# Altium schematic sheet ESC.SchDoc
size A3; SheetNumber: 1; SheetTotal: 1
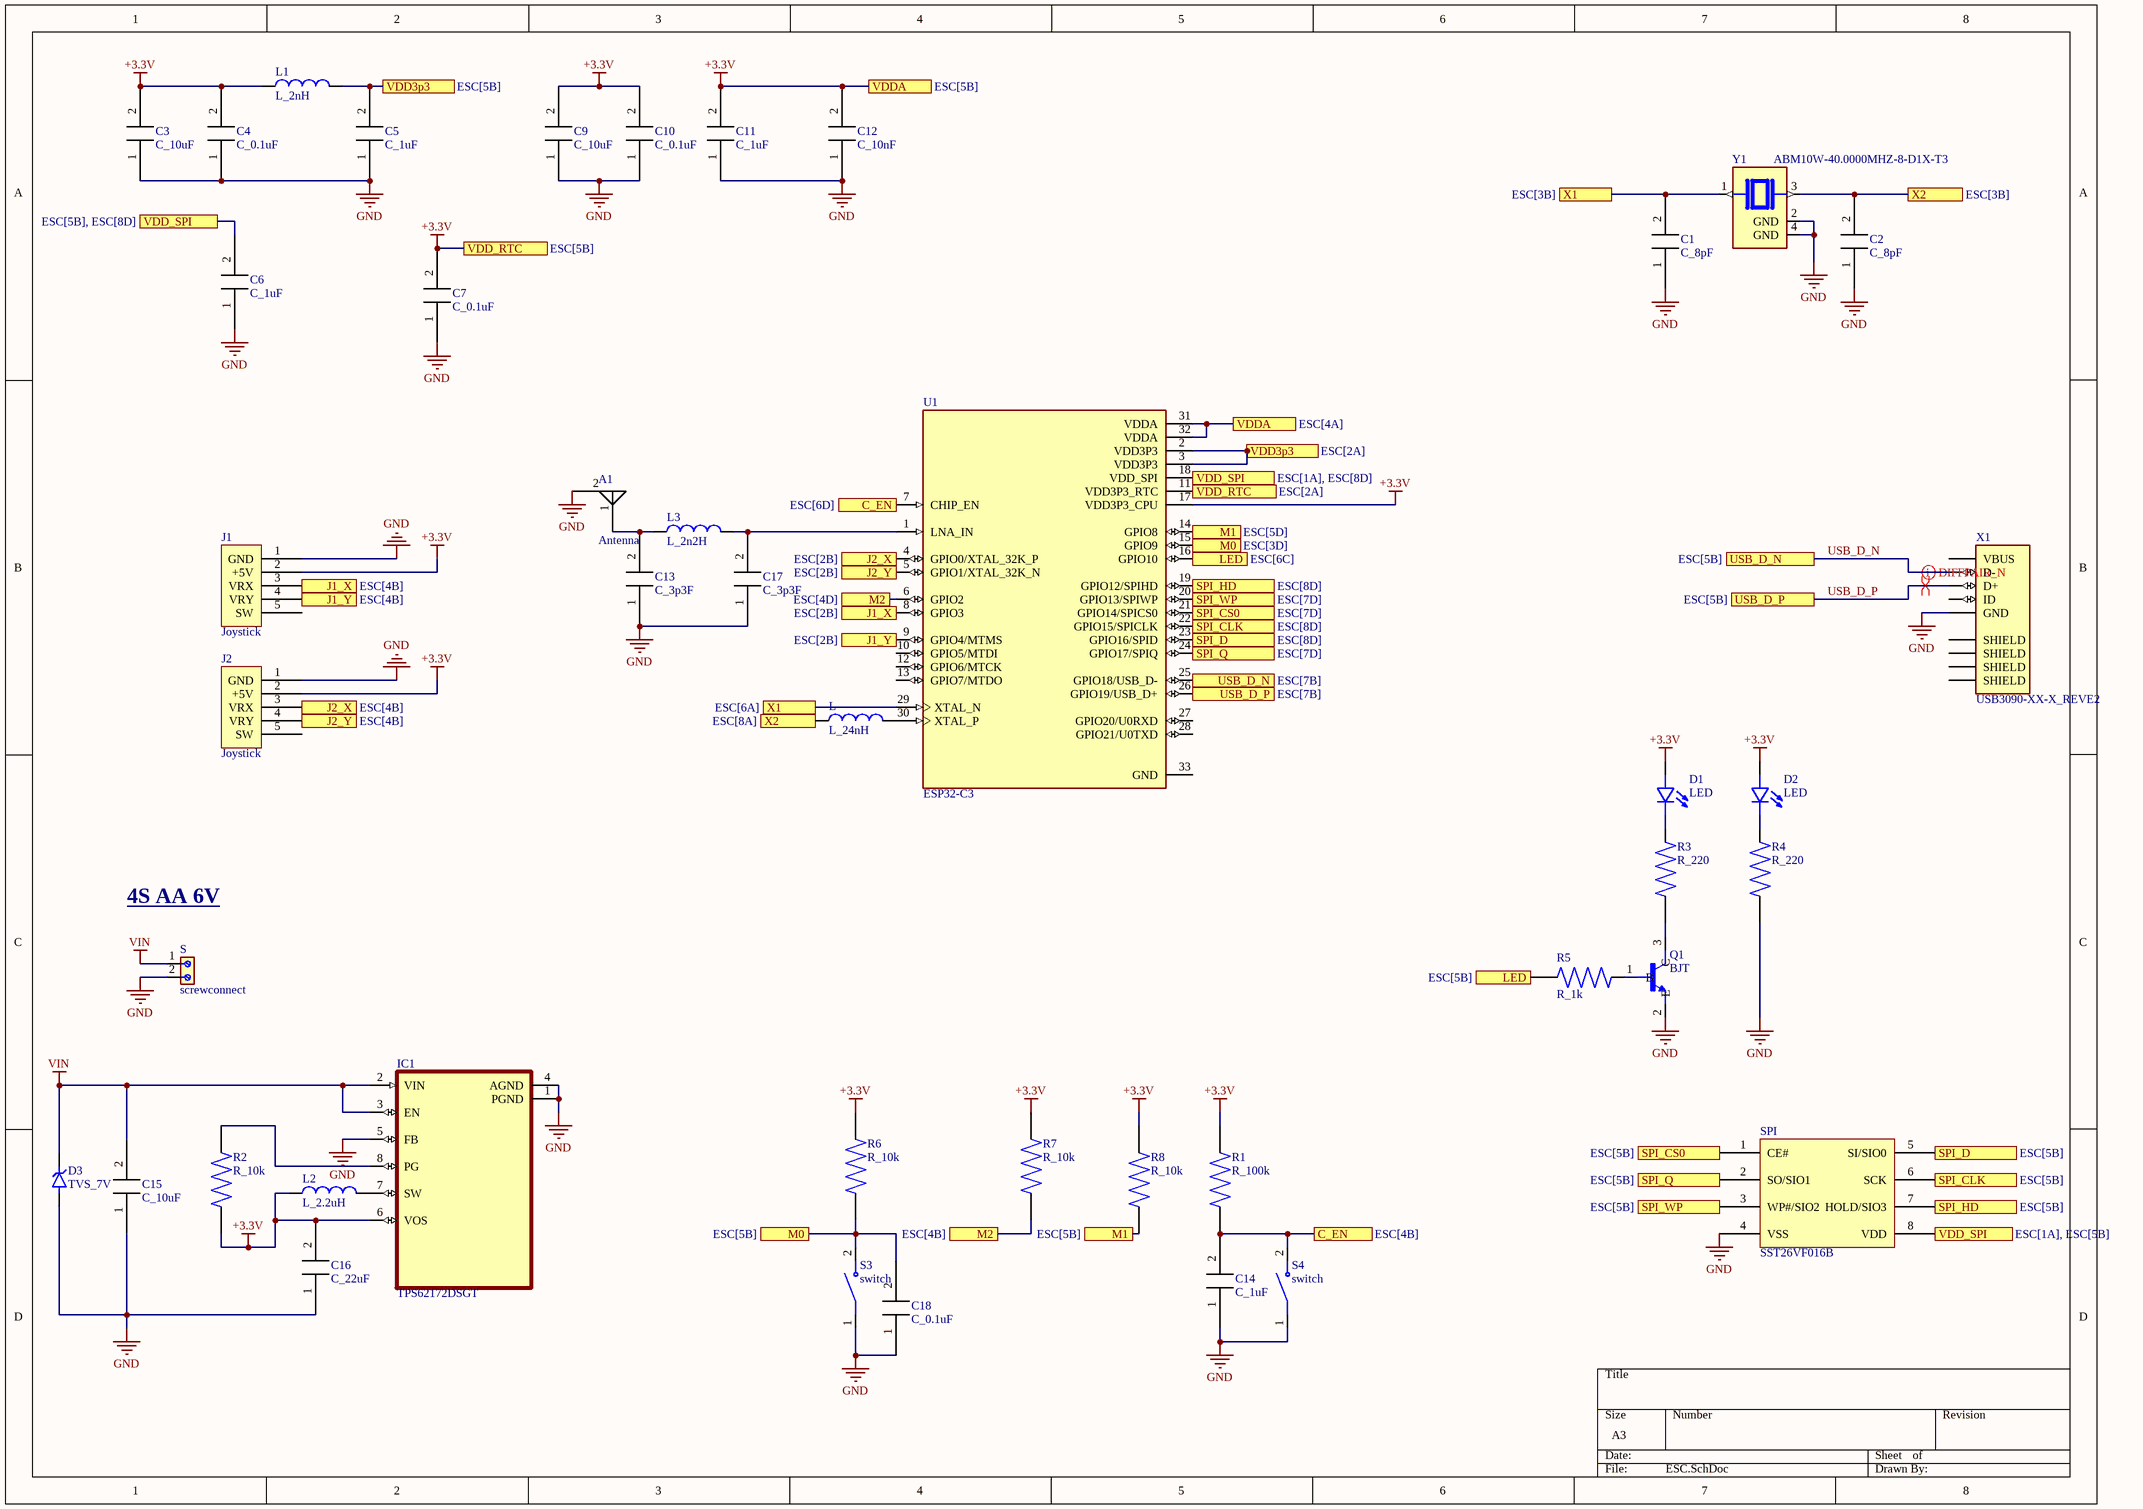
[diagram p0: ESC.SchDoc]

## Parts
A1  Antenna  [Antenna]
C1  C_8pF  [0603]
C2  C_8pF  [0603]
C3  C_10uF  [0603]
C4  C_0.1uF  [0603]
C5  C_1uF  [0603]
C6  C_1uF  [0603]
C7  C_0.1uF  [0603]
C9  C_10uF  [0603]
C10  C_0.1uF  [0603]
C11  C_1uF  [0603]
C12  C_10nF  [0603]
C13  C_3p3F  [0603]
C14  C_1uF  [0603]
C15  C_10uF  [0603]
C16  C_22uF  [0603]
C17  C_3p3F  [0603]
C18  C_0.1uF  [0603]
D1  LED  [LEDC3216X120N]
D2  LED  [LEDC3216X120N]
D3  TVS_7V  [TVS_6V]
IC1  TPS62172DSGT  [TPS62172]
J1  Joystick  [joystick]
J2  Joystick  [joystick]
L  L_24nH  [0603]
L1  L_2nH  [0603]
L2  L_2.2uH  [0603]
L3  L_2n2H  [0603]
Q1  BJT  [SOT95P240X111-3N]
R1  R_100k  [0603]
R2  R_10k  [0603]
R3  R_220  [0603]
R4  R_220  [0603]
R5  R_1k  [0603]
R6  R_10k  [0603]
R7  R_10k  [0603]
R8  R_10k  [0603]
S  screwconnect  [supply]
S3  switch  [switch]
S4  switch  [switch]
SPI  SST26VF016B  [SOIC127P600X175-8N]
U1  ESP32-C3  [QFN50P500X500X90-33N]
X1  USB3090-XX-X_REVE2  [GCT_USB3090-XX-X_REVE2]
Y1  ABM10W-40.0000MHZ-8-D1X-T3  [XTAL_ABM10W-40.0000MHZ-8-D1X-T3]

## Ports
C_EN (see ESC[4B]), C_EN (see ESC[6D]), J1_X (see ESC[2B]), J1_X (see ESC[4B]), J1_Y (see ESC[2B]), J1_Y (see ESC[4B]), J2_X (see ESC[2B]), J2_X (see ESC[4B]), J2_Y (see ESC[2B]), J2_Y (see ESC[4B]), LED (see ESC[5B]), LED (see ESC[6C]), M0 (see ESC[3D]), M0 (see ESC[5B]), M1 (see ESC[5B]), M1 (see ESC[5D]), M2 (see ESC[4B]), M2 (see ESC[4D]), SPI_CLK (see ESC[5B]), SPI_CLK (see ESC[8D]), SPI_CS0 (see ESC[5B]), SPI_CS0 (see ESC[7D]), SPI_D (see ESC[5B]), SPI_D (see ESC[8D]), SPI_HD (see ESC[5B]), SPI_HD (see ESC[8D]), SPI_Q (see ESC[5B]), SPI_Q (see ESC[7D]), SPI_WP (see ESC[5B]), SPI_WP (see ESC[7D]), USB_D_N (see ESC[5B]), USB_D_N (see ESC[7B]), USB_D_P (see ESC[5B]), USB_D_P (see ESC[7B]), VDD3p3 (see ESC[2A]), VDD3p3 (see ESC[5B]), VDD_RTC (see ESC[2A]), VDD_RTC (see ESC[5B]), VDD_SPI (see ESC[1A], ESC[5B]), VDD_SPI (see ESC[1A], ESC[8D]), VDD_SPI (see ESC[5B], ESC[8D]), VDDA (see ESC[4A]), VDDA (see ESC[5B]), X1 (see ESC[3B]), X1 (see ESC[6A]), X2 (see ESC[3B]), X2 (see ESC[8A])

## Nets
+3.3V: C3.2 C4.2 C7.2 C9.2 C10.2 C11.2 C12.2 C16.2 D1.POS D2.POS IC1.6(VOS) J1.2(+5V) J2.2(+5V) L1.1 L2.1 R1.2 R2.1 R6.2 R7.2 R8.2 U1.11(VDD3P3_RTC) U1.17(VDD3P3_CPU) U1.31(VDDA) U1.32(VDDA) ; port VDDA, port VDD_RTC
GND: A1.2 C1.1 C2.1 C3.1 C4.1 C5.1 C6.1 C7.1 C9.1 C10.1 C11.1 C12.1 C13.1 C14.1 C15.1 C16.1 C17.1 C18.1 D3.2(A) IC1.1(PGND) IC1.4(AGND) IC1.5(FB) J1.1(GND) J2.1(GND) Q1.2(E) R4.1 S.2 S3.1 S4.1 SPI.4(VSS) X1.5(GND) Y1.2(GND) Y1.4(GND)
VIN: C15.2 D3.1(K) IC1.2(VIN) IC1.3(EN) S.1
C_EN: C14.2 R1.1 S4.2 U1.7(CHIP_EN) ; port C_EN
J1_X: J1.3(VRX) U1.8(GPIO3) ; port J1_X
J1_Y: J1.4(VRY) U1.9(GPIO4/MTMS) ; port J1_Y
J2_X: J2.3(VRX) U1.4(GPIO0/XTAL_32K_P) ; port J2_X
J2_Y: J2.4(VRY) U1.5(GPIO1/XTAL_32K_N) ; port J2_Y
LED: R5.1 U1.16(GPIO10) ; port LED
M0: C18.2 R6.1 S3.2 U1.15(GPIO9) ; port M0
M1: R8.1 U1.14(GPIO8) ; port M1
M2: R7.1 U1.6(GPIO2) ; port M2
SPI_CLK: SPI.6(SCK) U1.22(GPIO15/SPICLK) ; port SPI_CLK
SPI_CS0: SPI.1(CE#) U1.21(GPIO14/SPICS0) ; port SPI_CS0
SPI_D: SPI.5(SI/SIO0) U1.23(GPIO16/SPID) ; port SPI_D
SPI_HD: SPI.7(HOLD/SIO3) U1.19(GPIO12/SPIHD) ; port SPI_HD
SPI_Q: SPI.2(SO/SIO1) U1.24(GPIO17/SPIQ) ; port SPI_Q
SPI_WP: SPI.3(WP#/SIO2) U1.20(GPIO13/SPIWP) ; port SPI_WP
USB_D_N: U1.25(GPIO18/USB_D-) X1.2(D-) ; port USB_D_N
USB_D_P: U1.26(GPIO19/USB_D+) X1.3(D+) ; port USB_D_P
VDD3p3: C5.2 L1.2 U1.2(VDD3P3) U1.3(VDD3P3) ; port VDD3p3
VDD_SPI: C6.2 SPI.8(VDD) U1.18(VDD_SPI) ; port VDD_SPI
X1: C1.2 U1.29(XTAL_N) Y1.1 ; port X1
X2: C2.2 L.1 Y1.3 ; port X2
NetA1_1: A1.1(feed) C13.2 L3.1
NetC17_2: C17.2 L3.2 U1.1(LNA_IN)
NetD1_NEG: D1.NEG R3.2
NetD2_NEG: D2.NEG R4.2
NetIC1_7: IC1.7(SW) L2.2
NetIC1_8: IC1.8(PG) R2.2
NetL_2: L.2 U1.30(XTAL_P)
NetQ1_1: Q1.1(B) R5.2
NetQ1_3: Q1.3(C) R3.1

Not connected (* = marked no-connect by the designer): J1 5(SW); J2 5(SW); U1 10(GPIO5/MTDI) 12(GPIO6/MTCK) 13(GPIO7/MTDO) 27(GPIO20/U0RXD) 28(GPIO21/U0TXD) 33(GND); X1 1(VBUS) 4(ID) SH1(SHIELD) SH2(SHIELD) SH3(SHIELD) SH4(SHIELD)

## Layout directives
differential pair: USB_D_N, USB_D_P

## Notes on the sheet
- 4S AA 6V

## Library data of the parts
D1 D2 = LED: 2.6 V Red LED SMD; MF: Osram; MP: LHN974 RED LED 1206; SnapEDA_Link: https://www.snapeda.com/parts/LHN974%20RED%20LED%201206/Osram/view-part/?ref=snap; Package: None; Value: *; Check_prices: https://www.snapeda.com/parts/LHN974%20RED%20LED%201206/Osram/view-part/?ref=eda
D3 = TVS_7V: 600W Surface Mount TVS Diode | Littelfuse SMBJ7.5A; MF: Littelfuse Inc.; Package: None; Price: None; Value: *; SnapEDA_Link: https://www.snapeda.com/parts/SMBJ7.5A/Littelfuse/view-part/?ref=snap; MP: SMBJ7.5A; Availability: Unavailable; Check_prices: https://www.snapeda.com/parts/SMBJ7.5A/Littelfuse/view-part/?ref=eda
IC1 = TPS62172DSGT: Buck Switching Regulator IC Positive Fixed 3.3V 1 Output 500mA 8-WFDFN Exposed Pad; MF: Texas Instruments; SnapEDA_Link: https://www.snapeda.com/parts/TPS62172DSG/Texas+Instruments/view-part/?ref=snap; Package: WSON-8 Texas Instruments; Value: *; MP: TPS62172DSG; Check_prices: https://www.snapeda.com/parts/TPS62172DSG/Texas+Instruments/view-part/?ref=eda
L = L_24nH: MP: DFE201612E-2R2M=P2; MF: Murata Electronics; Package: 2016 Murata; Availability: Unavailable; Value: *; SnapEDA_Link: https://www.snapeda.com/parts/DFE201612E-2R2M%3DP2/Murata%20Electronics%20North%20America/view-part/703024/?ref=snap; Price: None
L1 = L_2nH: MP: DFE201612E-2R2M=P2; MF: Murata Electronics; Package: 2016 Murata; Availability: Unavailable; Value: *; SnapEDA_Link: https://www.snapeda.com/parts/DFE201612E-2R2M%3DP2/Murata%20Electronics%20North%20America/view-part/703024/?ref=snap; Price: None
L2 = L_2.2uH: MP: DFE201612E-2R2M=P2; MF: Murata Electronics; Package: 2016 Murata; Availability: Unavailable; Value: *; SnapEDA_Link: https://www.snapeda.com/parts/DFE201612E-2R2M%3DP2/Murata%20Electronics%20North%20America/view-part/703024/?ref=snap; Price: None
L3 = L_2n2H: MP: DFE201612E-2R2M=P2; MF: Murata Electronics; Package: 2016 Murata; Availability: Unavailable; Value: *; SnapEDA_Link: https://www.snapeda.com/parts/DFE201612E-2R2M%3DP2/Murata%20Electronics%20North%20America/view-part/703024/?ref=snap; Price: None
Q1 = BJT: Transistor, Bipolar,Si,NPN,General Purpose,VCEO 40VDC,IC 200mA,PD 225mW,SOT-23 | ON Semiconductor MMBT3904LT1G; SnapEDA_Link: https://www.snapeda.com/parts/MMBT3904LT1G/Onsemi/view-part/?ref=snap; Package: SOT-23-3 ON Semiconductor; Value: *; MF: ON Semiconductor; MP: MMBT3904LT1G; Check_prices: https://www.snapeda.com/parts/MMBT3904LT1G/Onsemi/view-part/?ref=eda
R1 = R_100k: MF: Yageo; MP: MFR-25FBF52-10K; SnapEDA_Link: https://www.snapeda.com/parts/MFR-25FBF52-10K/Yageo/view-part/?ref=snap; Package: RADIAL-2 YAGEO; Value: *; Check_prices: https://www.snapeda.com/parts/MFR-25FBF52-10K/Yageo/view-part/?ref=eda
R2 R6-R8 = R_10k: MF: Yageo; MP: MFR-25FBF52-10K; SnapEDA_Link: https://www.snapeda.com/parts/MFR-25FBF52-10K/Yageo/view-part/?ref=snap; Package: RADIAL-2 YAGEO; Value: *; Check_prices: https://www.snapeda.com/parts/MFR-25FBF52-10K/Yageo/view-part/?ref=eda
R3 R4 = R_220: MF: Yageo; MP: MFR-25FBF52-10K; SnapEDA_Link: https://www.snapeda.com/parts/MFR-25FBF52-10K/Yageo/view-part/?ref=snap; Package: RADIAL-2 YAGEO; Value: *; Check_prices: https://www.snapeda.com/parts/MFR-25FBF52-10K/Yageo/view-part/?ref=eda
R5 = R_1k: MF: Yageo; MP: MFR-25FBF52-10K; SnapEDA_Link: https://www.snapeda.com/parts/MFR-25FBF52-10K/Yageo/view-part/?ref=snap; Package: RADIAL-2 YAGEO; Value: *; Check_prices: https://www.snapeda.com/parts/MFR-25FBF52-10K/Yageo/view-part/?ref=eda
S = screwconnect: 2 Position Wire to Board Terminal Block Horizontal with Board 0.197 (5.00mm) Through Hole; MF: WÃ¼rth Elektronik; MP: 691137710002; SnapEDA_Link: https://www.snapeda.com/parts/691137710002/W%25C3%25BCrth+Elektronik+Midcom/view-part/?ref=snap; Package: None; Value: *; Check_prices: https://www.snapeda.com/parts/691137710002/W%25C3%25BCrth+Elektronik+Midcom/view-part/?ref=eda
S3 S4 = switch: 6.1 x 3.7 mm, 2.5 mm Actuator Height, 160 gf, White, Surface Mount, SPST, Tactile Switch / TS09-63-25-WT-160-SMT-TR; MF: Same Sky; SnapEDA_Link: https://www.snapeda.com/parts/TS09-63-25-WT-160-SMT-TR/Same+Sky/view-part/?ref=snap; Package: None; Value: *; MP: TS09-63-25-WT-160-SMT-TR; Check_prices: https://www.snapeda.com/parts/TS09-63-25-WT-160-SMT-TR/Same+Sky/view-part/?ref=eda
U1 = ESP32-C3: WiFi Modules (802.11) (Engineering Samples Only) SMD IC ESP32-C3, RISC-V single-core MCU, 2.4G Wi-Fi & BLE 5.0 combo, QFN 32-pin, 5*5 mm, 40 ~ 105C; MF: Espressif Systems; SnapEDA_Link: https://www.snapeda.com/parts/ESP32-C3/Espressif+Systems/view-part/?ref=snap; Package: VFQFN-32 Espressif Systems; Value: *; MP: ESP32-C3; Check_prices: https://www.snapeda.com/parts/ESP32-C3/Espressif+Systems/view-part/?ref=eda
X1 = USB3090-XX-X_REVE2: USB - micro AB USB 2.0 Receptacle Connector 5 Position Surface Mount, Right Angle; Through Hole, 2.35mm profile, 5 Pins, Horizontal, Bottom mount; MF: Global Connector Technology; MP: USB3090-30-A; SnapEDA_Link: https://www.snapeda.com/parts/USB3090-30-A/Global+Connector+Technology/view-part/?ref=snap; Package: None; Value: *; Check_prices: https://www.snapeda.com/parts/USB3090-30-A/Global+Connector+Technology/view-part/?ref=eda
Y1 = ABM10W-40.0000MHZ-8-D1X-T3: IoT OPTIMIZED LOW PROFILE QUARTZ CRYSTAL; MF: Abracon; SnapEDA_Link: https://www.snapeda.com/parts/ABM10W-40.0000MHZ-8-D1X-T3/Abracon/view-part/?ref=snap; Package: SMD-4 Abracon; Value: *; MP: ABM10W-40.0000MHZ-8-D1X-T3; Check_prices: https://www.snapeda.com/parts/ABM10W-40.0000MHZ-8-D1X-T3/Abracon/view-part/?ref=eda